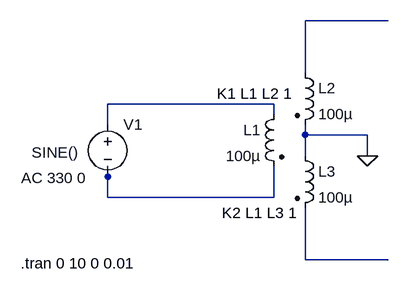
[diagram p0: schematic PSU.asc]
PSU.asc, the LTspice schematic file:
Version 4
SHEET 1 880 680
WIRE 320 -240 192 -240
WIRE 192 -160 192 -240
WIRE 144 -112 -112 -112
WIRE 144 -96 144 -112
WIRE -112 -80 -112 -112
WIRE 192 -64 192 -80
WIRE 288 -64 192 -64
WIRE 192 -32 192 -64
WIRE 288 -32 288 -64
WIRE -112 0 -112 -16
WIRE -112 32 -112 0
WIRE 144 32 144 -16
WIRE 144 32 -112 32
WIRE 192 128 192 48
WIRE 320 128 192 128
FLAG 288 -32 0
SYMBOL voltage -112 -96 R0
WINDOW 123 -133 98 Left 2
WINDOW 39 0 0 Left 2
WINDOW 3 -117 59 Left 2
SYMATTR Value2 AC 330 0
SYMATTR InstName V1
SYMATTR Value SINE()
SYMBOL ind2 160 -112 M0
SYMATTR InstName L1
SYMATTR Value 100µ
SYMATTR Type ind
SYMBOL ind2 176 -176 R0
SYMATTR InstName L2
SYMATTR Value 100µ
SYMATTR Type ind
SYMBOL ind2 176 -48 R0
SYMATTR InstName L3
SYMATTR Value 100µ
SYMATTR Type ind
TEXT 56 -128 Left 2 !K1 L1 L2 1
TEXT 64 56 Left 2 !K2 L1 L3 1
TEXT -246 134 Left 2 !.tran 0 10 0 0.01

The netlist it stands for:
* PSU.asc
V1 N002 N003 SINE() AC 330 0
L1 N002 N003 100µ
L2 N001 0 100µ
L3 0 N004 100µ
K1 L1 L2 1
K2 L1 L3 1
.tran 0 10 0 0.01
.backanno
.end